# Altium schematic sheet RCD300_P0.SchDoc
size A4
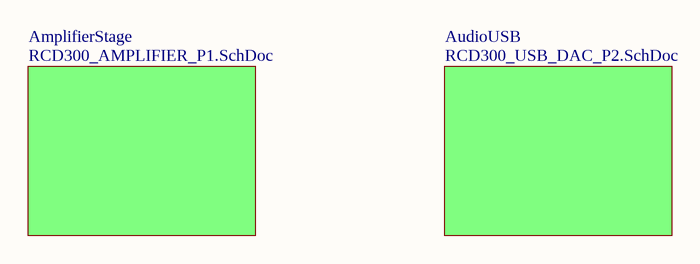
[diagram p0: RCD300_P0.SchDoc]

## Sub-sheets
AmplifierStage = RCD300_AMPLIFIER_P1.SchDoc: no entries
AudioUSB = RCD300_USB_DAC_P2.SchDoc: no entries